# Altium schematic sheet DebugSwitch.SchDoc
size A4
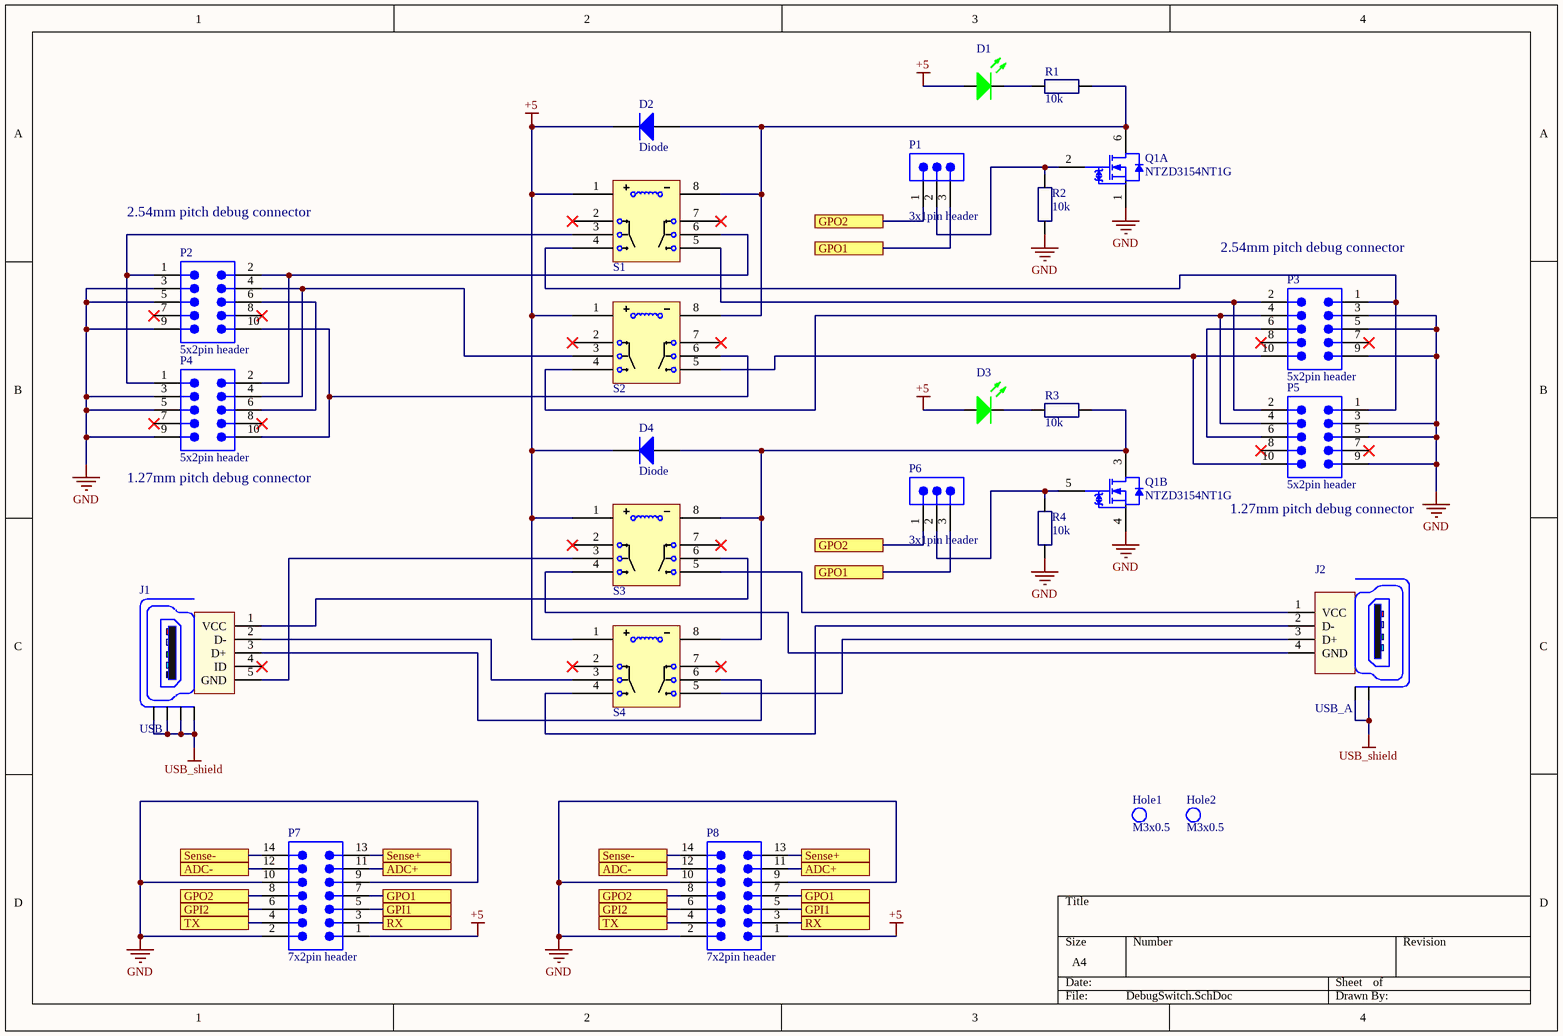
[diagram p0: DebugSwitch.SchDoc]

## Parts
D1  LED_GREEN  [LED_0603]  (value not drawn)
D2  Diode  [SOD-123]
D3  LED_GREEN  [LED_0603]  (value not drawn)
D4  Diode  [SOD-123]
Hole1  M3x0.5  [M3x0.5]
Hole2  M3x0.5  [M3x0.5]
J1  USB  [USB_microB]
J2  USB_A  [USB-A-S-F-W-SM2]
P1  3x1pin header  [TSM-103-01-T-SV]
P2  5x2pin header  [TSM-105-01-L-DV]
P3  5x2pin header  [TSM-105-01-L-DV]
P4  5x2pin header  [FTSH-105-01-F-DV]
P5  5x2pin header  [FTSH-105-01-F-DV]
P6  3x1pin header  [TSM-103-01-T-SV]
P7  7x2pin header  [SSQ-107-02-T-D-RA]
P8  7x2pin header  [TSS-107-04-L-D-RA]
Q1  NTZD3154NT1G  [SOT-563-6]  (parts A,B of 2)
R1  value 10k  [RES_0402]  (hidden comment: RES_0402)
R2  value 10k  [RES_0402]  (hidden comment: RES_0402)
R3  value 10k  [RES_0402]  (hidden comment: RES_0402)
R4  value 10k  [RES_0402]  (hidden comment: RES_0402)
S1  Relay_DPDT  [EE2-5NU]  (value not drawn)
S2  Relay_DPDT  [EE2-5NU]  (value not drawn)
S3  Relay_DPDT  [EE2-5NU]  (value not drawn)
S4  Relay_DPDT  [EE2-5NU]  (value not drawn)

## Ports
ADC+, ADC-, GPI1, GPI2, GPO1, GPO2, RX, Sense+, Sense-, TX

## Nets
+5: D1.2(A) D2.1(K) D3.2(A) D4.1(K) P7.1 P8.1 S1.1 S2.1 S3.1 S4.1
GND: P2.3 P2.5 P2.9 P3.3 P3.5 P3.9 P4.3 P4.5 P4.9 P5.3 P5.5 P5.9 P7.2 P7.9 P7.10 P8.2 P8.9 P8.10 Q1.1(S1) Q1.4(S2) R2.1 R4.1
USB_shield: J1.Z1(Shield) J1.Z2(Shield) J1.Z3(Shield) J1.Z4(Shield) J2.Z1(Shield) J2.Z2(Shield)
ADC+: P7.11 P8.11 ; port ADC+
ADC-: P7.12 P8.12 ; port ADC-
GPI1: P7.5 P8.5 ; port GPI1
GPI2: P7.6 P8.6 ; port GPI2
GPO1: P1.3 P6.3 P7.7 P8.7 ; port GPO1
GPO2: P1.1 P6.1 P7.8 P8.8 ; port GPO2
RX: P7.3 P8.3 ; port RX
Sense+: P7.13 P8.13 ; port Sense+
Sense-: P7.14 P8.14 ; port Sense-
TX: P7.4 P8.4 ; port TX
NetD1_1: D1.1(K) R1.1
NetD2_2: D2.2(A) Q1.6(D1) R1.2 S1.8 S2.8
NetD3_1: D3.1(K) R3.1
NetD4_2: D4.2(A) Q1.3(D2) R3.2 S3.8 S4.8
NetJ1_1: J1.1(VCC) S3.6
NetJ1_2: J1.2(D-) S4.3
NetJ1_3: J1.3(D+) S4.6
NetJ1_5: J1.5(GND) S3.3
NetJ2_1: J2.1(VCC) S3.5
NetJ2_2: J2.2(D-) S4.4
NetJ2_3: J2.3(D+) S4.5
NetJ2_4: J2.4(GND) S3.4
NetP1_2: P1.2 Q1.2(G1) R2.2
NetP2_1: P2.1 P4.1 S1.3
NetP2_2: P2.2 P4.2 S1.6
NetP2_4: P2.4 P4.4 S2.3
NetP2_6: P2.6 P4.6
NetP2_10: P2.10 P4.10 S2.6
NetP3_1: P3.1 P5.1 S1.4
NetP3_2: P3.2 P5.2 S1.5
NetP3_4: P3.4 P5.4 S2.4
NetP3_6: P3.6 P5.6
NetP3_10: P3.10 P5.10 S2.5
NetP6_2: P6.2 Q1.5(G2) R4.2

Not connected (* = marked no-connect by the designer): J1 4(ID)*; P2 7* 8*; P3 7* 8*; P4 7* 8*; P5 7* 8*; S1 2* 7*; S2 2* 7*; S3 2* 7*; S4 2* 7*

## Notes on the sheet
- 2.54mm pitch debug connector
- (near P3) 2.54mm pitch debug connector
- (near P4) 1.27mm pitch debug connector
- (near P5) 1.27mm pitch debug connector

## Library data of the parts
D2 D4 = Diode: Generic diode; ComponentLink1Description: Manufacturer Link; ComponentLink1URL: http://www.infineon.com/; ComponentLink2Description: Datasheet; ComponentLink2URL: http://www.infineon.com/upload/Document/cmc_upload/documents/080/120/ba592_ba892series_1.pdf; Supplier 1: DigiKey; Supplier Part Number 1: 1N4148W-E3-08CT-ND
J1 = USB: ComponentLink1 Description: Manufacturer; ComponentLink2 Description: Datasheet; ComponentLink1URL: http://www.we-online.de; ComponentLink2URL: http://katalog.we-online.de/em/datasheet/65100516121.pdf; Supplier 1: DigiKey; Supplier Part Number 1: 732-3155-1-ND
J2 = USB_A: ComponentLink1 Description: Manufacturer; ComponentLink2 Description: Datasheet; ComponentLink1URL: http://www.we-online.de; ComponentLink2URL: http://katalog.we-online.de/em/datasheet/65100516121.pdf; Supplier 1: DigiKey; Supplier Part Number 1: SAM10368-ND
P1 P6 = 3x1pin header: Manufacturer: Samtec; Pitch: 2.54 mm; Mounting Technology: Surface Mount; PartNumber: TSM-103-01-T-SV; Supplier Part number 1: SAM10791-ND; Supplier 1: DigiKey
P2 P3 = 5x2pin header: Manufacturer: Samtec; Pitch: 2.54 mm; Mounting Technology: Surface Mount; PartNumber: TSM-105-01-L-DV; Supplier Part Number 1: SAM8984-ND; Supplier 1: DigiKey
P4 P5 = 5x2pin header: Manufacturer: Samtec; PartNumber: TSM-105-01-L-DV; Pitch: 2.54 mm; Mounting Technology: Surface Mount; Supplier Part Number 1: SAM8796-ND; Supplier 1: DigiKey
P7 P8 = 7x2pin header: Manufacturer: Samtec; PartNumber: HTSS-107-01-L-DV; Pitch: 2.54 mm; Mounting Technology: Surface Mount; Supplier 1: DigiKey
  P7: Supplier Part Number 1: SAM1224-07-ND
  P8: Supplier Part Number 1: SAM10311-ND
Q1 = NTZD3154NT1G: Small Signal MOSFET, 20 V, 540 mA, Dual N-Channel, 6-Pin SOT-563, Pb-Free, Tape and Reel; Manufacturer: On Semiconductor; Channel Polarity: N Channel; Ciss Typ (pF): 80; Coss Typ (pF): 13; Crss Typ (pF): 10; ID Max (A): 0.54; V(BR)DSS Min (V): 20; VGS Max (V): 6; VGS(th) Max (V): 1; DatasheetVersion: Rev. 2; PackageVersion: Rev. F, 04/2005; PackageReference: SOT-563-6-463A-01; PackageDescription: 6-Pin Small Outline Transistor, Body 1.6 x 1.2 mm, Pitch 0.5 mm; Configuration: Dual; Package Type: SOT-563; Packing: Tape and Reel; RoHS: Pb-Free; Mounting Technology: Surface Mount; PartNumber: NTZD3154NT1G; ComponentLink1Description: Manufacturer URL; ComponentLink1URL: http://www.onsemi.com/; ComponentLink2Description: Datasheet; ComponentLink2URL: http://www.onsemi.com/pub_link/Collateral/NTZD3154N-D.PDF; ComponentLink3Description: Package Specification; ComponentLink3URL: http://www.onsemi.cn/pub_link/Collateral/463A-01.PDF; Supplier 1: DigiKey; Supplier Part Number 1: NTZD3154NT1GOSCT-ND
R1-R4 = RES_0402: SMD Chip Resistor 0402; SIGN: HL; PartDescription: Chip resistor; Supplier 1: DigiKey; Package: 0402; Component Class: A
  R1 R3: Supplier Part Number 1: P100LCT-ND
  R2 R4: Supplier Part Number 1: P10.0KLCT-ND
S1-S4 = Relay_DPDT: Relay DPDT; Supplier 1: DigiKey; Supplier Part Number 1: 399-11056-5-ND
D1 D3 = LED_GREEN: Supplier 1: DigiKey; Supplier Part Number 1: 732-4971-1-ND